# EAGLE design hb-featherwing_v2 (EAGLE 8.3.1)
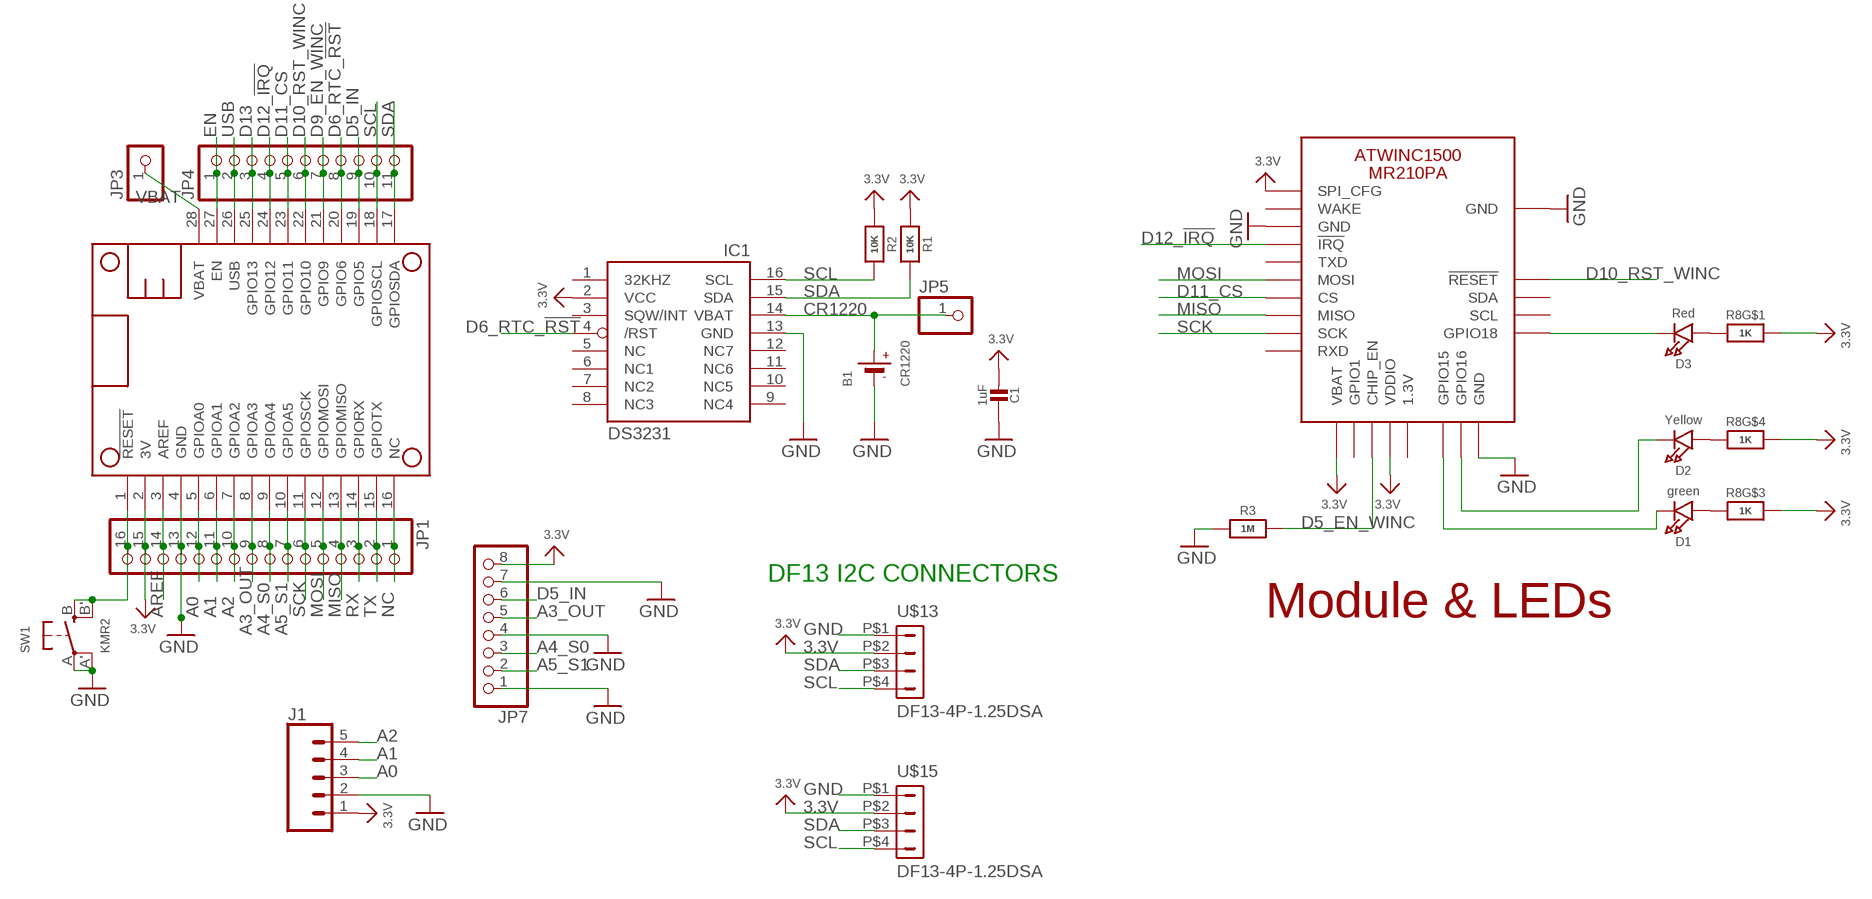
[diagram p0: schematic, sheet 1]

## Parts
B1  CR1220  BATTERYCR1220_2  [CR1220-2]
C1  1uF  CAP_CERAMIC0805-NOOUTLINE  [0805-NO]
D1  green  LED0805_NOOUTLINE  [CHIPLED_0805_NOOUTLINE]
D2  Yellow  LED0805_NOOUTLINE  [CHIPLED_0805_NOOUTLINE]
D3  Red  LED0805_NOOUTLINE  [CHIPLED_0805_NOOUTLINE]
IC1  DS3231/SO  [SO16W]
J1  CONN_05  [1X05]
JP1  HEADER-1X16ROUND  [1X16_ROUND]
JP3  HEADER-1X1ROUND  [1X01_ROUND]
JP4  HEADER-1X11  [1X11_ROUND]
JP5  HEADER-1X1ROUND  [1X01_ROUND]
JP7  PINHD-1X8BIG  [1X08-BIG]
MS1  MICROSHIELD_NODIM  [MICROSHIELD_DIM]
R1  10K  RESISTOR0805_NOOUTLINE  [0805-NO]
R2  10K  RESISTOR0805_NOOUTLINE  [0805-NO]
R3  1M  RESISTOR0805_NOOUTLINE  [0805-NO]
R8  1K  RESISTOR_4PACK  [RESPACK_4X0603]
SW1  KMR2  SWITCH_TACT_SMT4.6X2.8  [BTN_KMR2_4.6X2.8]
U$7  ATWINC1500_MR210PB  ATWINC1500_MR210PA  [ATWINC1500_MR210PA]
U$13  DF13-4P-1.25DSA  [DF13-4P-1.25DSA]
U$15  DF13-4P-1.25DSA  [DF13-4P-1.25DSA]

## Nets
3.3V: C1.2 IC1.2(VCC) J1.1 JP1.15 JP7.8 MS1.2(3V) R1.1 R2.1 R8.5 R8.6 R8.8 U$7.J10(SPI_CFG) U$7.J20(VBAT) U$7.J23(VDDIO) U$13.P$2 U$15.P$2
A0: J1.3 JP1.12 MS1.5(GPIOA0)
A1: J1.4 JP1.11 MS1.6(GPIOA1)
A2: J1.5 JP1.10 MS1.7(GPIOA2)
A3_OUT: JP1.9 JP7.5 MS1.8(GPIOA3)
A4_S0: JP1.8 JP7.3 MS1.9(GPIOA4)
A5_S1: JP1.7 JP7.2 MS1.10(GPIOA5)
AREF: JP1.14 MS1.3(AREF)
CR1220: B1.+ IC1.14(VBAT) JP5.1
D5_EN_WINC: R3.2 U$7.J22(CHIP_EN)
D5_IN: JP4.9 JP7.6 MS1.19(GPIO5)
D6_RTC_!RST: IC1.4(/RST) JP4.8 MS1.20(GPIO6)
D9_EN_WINC: JP4.7 MS1.21(GPIO9)
D10_RST_WINC: JP4.6 MS1.22(GPIO10) U$7.J4(!RESET)
D11_CS: JP4.5 MS1.23(GPIO11) U$7.J16(CS)
D12_!IRQ: JP4.4 MS1.24(GPIO12) U$7.J13(!IRQ)
D13: JP4.3 MS1.25(GPIO13)
EN: JP4.1 MS1.27(EN)
GND: B1.- C1.1 IC1.13(GND) J1.2 JP1.13 JP7.1 JP7.4 JP7.7 MS1.4(GND) R3.1 SW1.A'(P1) SW1.A(P) U$7.J9(GND) U$7.J12(GND) U$7.J28(GND) U$7.MTGND(GND) U$13.P$1 U$15.P$1
GPIO15: D1.C U$7.J26(GPIO15)
GPIO16: D2.C U$7.J27(GPIO16)
GPIO18: D3.C U$7.J1(GPIO18)
MISO: JP1.4 MS1.13(GPIOMISO) U$7.J17(MISO)
MOSI: JP1.5 MS1.12(GPIOMOSI) U$7.J15(MOSI)
N$1: D3.A R8.1
N$22: D2.A R8.4
N$24: D1.A R8.3
N$25: JP1.16 MS1.1(!RESET) SW1.B'(S1) SW1.B(S)
NC: JP1.1 MS1.16(NC)
RX: JP1.3 MS1.14(GPIORX)
SCK: JP1.6 MS1.11(GPIOSCK) U$7.J18(SCK)
SCL: IC1.16(SCL) JP4.10 MS1.18(GPIOSCL) R2.2 U$13.P$4 U$15.P$4
SDA: IC1.15(SDA) JP4.11 MS1.17(GPIOSDA) R1.2 U$13.P$3 U$15.P$3
TX: JP1.2 MS1.15(GPIOTX)
USB: JP4.2 MS1.26(USB)
VBAT: JP3.1 MS1.28(VBAT)
Unconnected: IC1.1(32KHZ) IC1.3(SQW/INT) IC1.5(NC) IC1.6(NC1) IC1.7(NC2) IC1.8(NC3) IC1.9(NC4) IC1.10(NC5) IC1.11(NC6) IC1.12(NC7) R8.2 R8.7 U$7.J2(SCL) U$7.J3(SDA) U$7.J11(WAKE) U$7.J14(TXD) U$7.J19(RXD) U$7.J21(GPIO1) U$7.J24(1.3V)

## Notes on the sheet
- DF13 I2C CONNECTORS
- Module & LEDs

## Library data of the parts
B1 = microbuilder:BATTERY: CR1220 SMT - Digikey: 3001K-ND CD2032 BAT-HLD-001 - Digikey: BAT-HLD-001-ND
C1 = microbuilder:CAP_CERAMIC: Ceramic Capacitors For new designs, use the packages preceded by an '_' character since they are more reliable: The following footprints should be used on most boards: _0402 - Standard footprint for regular board layouts _0603 - Standard footprint for regular board layouts _0805 - Standard footprint for regular board layouts _1206 - Standard footprint for regular board layouts For extremely tight-pitch boards where space is at a premium, the following 'micro-pitch' footprints can be used (smaller pads, no silkscreen outline, etc.): _0402MP - Micro-pitch footprint for very dense/compact boards _0603MP - Micro-pitch footprint for very dense/compact boards _0805MP - Micro-pitch footprint for very dense/compact boards _1206MP - Micro-pitch footprint for very dense/compact boards
D1-D3 = microbuilder:LED: LED 0603 - 0603 Surface Mount Package 2mA: Green LED - Low Power (3.9mcd, 2ma, 1.7Vf) - Digikey: 475-2709-2-ND Orange LED - Low Power (9.8mcd, 2ma, 1.8Vf) - Digikey: 475-1194-2-ND Red LED - Low Power (5mcd, 2ma, 1.8Vf) - Digikey: 475-1195-2-ND Yellow LED - Low Power (7mcd, 2ma, 1.8Vf) - Digikey: 475-1196-2-ND 5mA: Blue LED - Low Power (17mcd, 5ma, 2.9Vf) - Digikey: LNJ937W8CRACT-ND 0805 - 0805 Surface Mount Package 2mA: Red LED (8.8mcd, 2mA, 1.8Vf, Clear) - Low Power [Digikey: 475-2510-1-ND] Green LED (5mcd, 2mA, 1.8Vf, Clear) - Low Power [Digikey: 475-2730-1-ND] Yellow LED (11.3mcd, 2mA, 1.8Vf, Clear) - Low Power [Digikey: 475-2555-1-ND] 20mA: Red LED (104mcd, 20mA, Diffused) - LS R976 [Digikey: 475-1278-6-ND] Red LED (12mcd, 20mA, 2.0Vf, Clear) - APT2012EC [Digikey: 754-1128-1-ND] Green LED (15mcd, 20mA, 2.2Vf, Clear) - APT2012GC [Digikey: 754-1131-1-ND] Orange LED (160mcd, 20mA, 2.1Vf, Clear) - APT2012SECK [Digikey: 754-1130-1-ND] 1206 - 1206 Surface Mount Package Green LED (26mcd, 20mA, Diffused) - LG N971 [Digikey: 475-1407-6-ND] Red LED (15mcd, 20mA, Diffused) - LH N974 [Digikey: 475-1416-6-ND] Cree - Cree High-Power Surface Mount LEDs XPEBWT-L1-0000-00D50 - White 111lm 350mA 2.9Vf 6200K 110° XTEAWT-00-0000-00000LEE3 - White 114lm 350mA 2.85Vf 5000K 115° Everlight - Everlight 45-21 Series Surface Mount LEDs 45-21/QK2C-B2832AC2CB2/2T - Warm White 2000mcd 20mA 3.25Vf 3050K 120° 45-21/LK2C-B38452C4CB2/2T - Nuetral White 2000mcd 20mA 3.25Vf 4150K 120° 45-21/LK2C-B50634C6CB2/2T - Cold White 2200mcd 20mA 3.25Vf 5650K 120° PLCC2 Reverse Mount LS T77K-J1L2-1-0-2-R18-Z - Red 11.25mcd 2mA 1.8Vf 630nm 120° LO T77K-L1M2-24-Z - Orange 19.6mcd 2mA 1.8Vf 606nm 120° LY T77K-K2M1-26-Z - Yellow 15.7mcd 2mA 1.8Vf 587nm 120°
IC1 = adafruit:DS3231
J1 = SparkFun-Connectors:CONN_05: Multi connection point. Often used as Generic Header-pin footprint for 0.1 inch spaced/style header connections On any of the 0.1 inch spaced packages, you can populate with these: Break Away Headers - Straight <https://www.sparkfun.com/products/116> (PRT-00116) Break Away Male Headers - Right Angle <https://www.sparkfun.com/products/553> (PRT-00553) Female Headers <https://www.sparkfun.com/products/115> (PRT-00115) Break Away Headers - Machine Pin <https://www.sparkfun.com/products/117> (PRT-00117) Break Away Female Headers - Swiss Machine Pin <https://www.sparkfun.com/products/743> (PRT-00743) For SCREWTERMINALS and SPRING TERMINALS visit here: Screw Terimnals on SparkFun.com <https://www.sparkfun.com/search/results?term=Screw+Terminals> (5mm/3.5mm/2.54mm spacing) This device is also useful as a general connection point to wire up your design to another part of your project. Our various solder wires solder well into these plated through hole pads. Hook-Up Wire - Assortment (Stranded, 22 AWG) <https://www.sparkfun.com/products/11375> (PRT-11375) Hook-Up Wire - Assortment (Solid Core, 22 AWG) <https://www.sparkfun.com/products/11367> (PRT-11367) View the entire wire category on our website here <https://www.sparkfun.com/categories/141> Special notes: Molex polarized connector foot print use with SKU : PRT-08231 with associated crimp pins and housings. 1MM SMD Version SKU: PRT-10208
JP1 = microbuilder:HEADER-1X16: PIN HEADER
JP3 JP5 = microbuilder:HEADER-1X1: PIN HEADER
JP4 = microbuilder:HEADER-1X11
JP7 = adafruit:PINHD-1X8: PIN HEADER
MS1 = microbuilder:MICROSHIELD
R1-R3 = microbuilder:RESISTOR: Resistors For new designs, use the packages preceded by an '_' character since they are more reliable: The following footprints should be used on most boards: _0402 - Standard footprint for regular board layouts _0603 - Standard footprint for regular board layouts _0805 - Standard footprint for regular board layouts _1206 - Standard footprint for regular board layouts For extremely tight-pitch boards where space is at a premium, the following 'micro-pitch' footprints can be used (smaller pads, no silkscreen outline, etc.): _0402MP - Micro-pitch footprint for very dense/compact boards _0603MP - Micro-pitch footprint for very dense/compact boards _0805MP - Micro-pitch footprint for very dense/compact boards _1206MP - Micro-pitch footprint for very dense/compact boards
R8 = microbuilder:RESISTOR_4PACK: Resistor Packs (4 resistors) 4 x 0603 10K 1/16W - Digikey: YC164J-10KCT-ND
SW1 = microbuilder:SWITCH_TACT_SMT: SMT Tact Switches 6x6mm - Digikey: P12940SCT-ND KMR2 (4.6x2.8mm) - Digikey: 401-1426-1-ND EVQ-PQHB55 - Light Touch, 160GF (4.5x4.5mm) - Digikey: P8090SCT-ND KMT0 - KMT021 NGJ LHS (etc.) IP68/Waterproof - Digikey: CKN10289CT-ND
U$7 = microbuilder:ATWINC1500_MR210PA: ATWINC1500_MR210PA wifi module
U$13 U$15 = con-hirose-df13:DF13-4P-1.25: DF13-4P 1.25mm Pitch Miniature Crimping Connector.

## Board
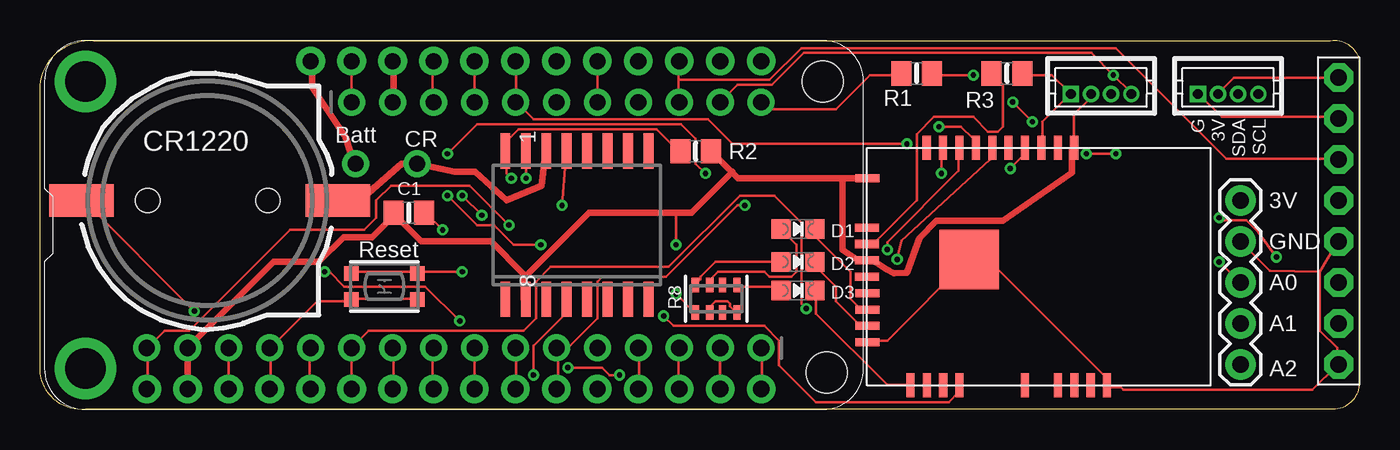
[diagram p1: board, top side]
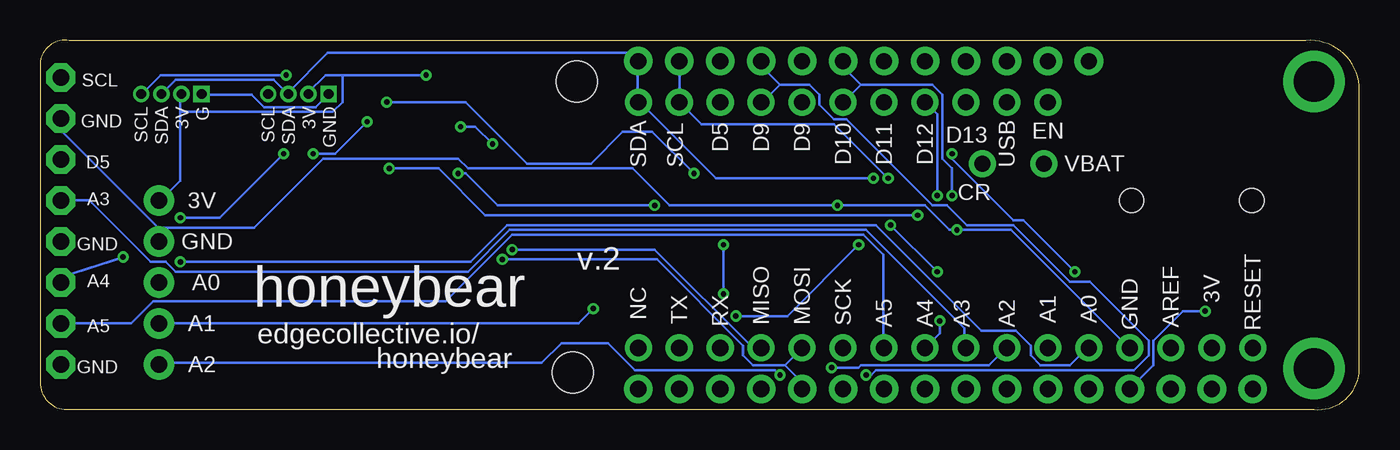
[diagram p2: board, bottom side, seen from below]

Size 81.79 x 22.89 mm. Coordinates in mm from the lower left corner, seen from the top.
Outline: 80.01,0.01 2.79,0.01 arc-90 0,2.3 0,20.08 arc-90 3.3,22.87 80.01,22.87 arc-90 81.79,21.6 81.79,1.54 arc-90 80.01,0.01
Copper layers (1*16): Top 0.0356mm / dielectric 1.5011mm / Bottom 0.0356mm
Design rules "LaenPCBOrder": minimum track width 6mil, minimum drill 13mil, track to track 6mil, track to pad 6mil, pad to pad 6mil, via to via 6mil, smd to smd 6mil, copper to edge 15mil, drill to drill 6mil, minimum pad ring 7mil, minimum via ring 7mil, stop-mask expansion 3mil, vias tented up to drill 0mil, thermal gap 10mil

### Footprints (pad centres in the part's own frame; a part is rotated, then mirrored left to right if it is on the bottom)
CR1220-2 = smd 4 x 2: + 8.29,0; - -7.6,0 | hole 1.5: 3.95,0; -3.5,0
0805-NO = smd 1.24 x 1.5: 1 -0.95,0; 2 0.95,0
CHIPLED_0805_NOOUTLINE = smd 1.2 x 1.2: A 0,-1.05; C 0,1.05
SO16W = smd 0.6 x 2.2: 1 -4.445,-4.6; 2 -3.175,-4.6; 3 -1.905,-4.6; 4 -0.635,-4.6; 5 0.635,-4.6; 6 1.905,-4.6; 7 3.175,-4.6; 8 4.445,-4.6; 9 4.445,4.6; 10 3.175,4.6; 11 1.905,4.6; 12 0.635,4.6; 13 -0.635,4.6; 14 -1.905,4.6; 15 -3.175,4.6; 16 -4.445,4.6
1X05 = drill 1.016 pad 1.88: 1 0,0; 2 2.54,0; 3 5.08,0; 4 7.62,0; 5 10.16,0
1X16_ROUND = drill 1 pad 1.676: 1 -19.05,0; 2 -16.51,0; 3 -13.97,0; 4 -11.43,0; 5 -8.89,0; 6 -6.35,0; 7 -3.81,0; 8 -1.27,0; 9 1.27,0; 10 3.81,0; 11 6.35,0; 12 8.89,0; 13 11.43,0; 14 13.97,0; 15 16.51,0; 16 19.05,0
1X01_ROUND = drill 1 pad 1.676: 1 0,0
1X11_ROUND = drill 1 pad 1.676: 1 -12.7,0; 2 -10.16,0; 3 -7.62,0; 4 -5.08,0; 5 -2.54,0; 6 0,0; 7 2.54,0; 8 5.08,0; 9 7.62,0; 10 10.16,0; 11 12.7,0
1X08-BIG = drill 1.016 pad 1.778 octagon: 1 -8.89,0; 2 -6.35,0; 3 -3.81,0; 4 -1.27,0; 5 1.27,0; 6 3.81,0; 7 6.35,0; 8 8.89,0
MICROSHIELD_DIM = drill 1 pad 1.778: 1 6.35,1.27; 2 8.89,1.27; 3 11.43,1.27; 4 13.97,1.27; 5 16.51,1.27; 6 19.05,1.27; 7 21.59,1.27; 8 24.13,1.27; 9 26.67,1.27; 10 29.21,1.27; 11 31.75,1.27; 12 34.29,1.27; 13 36.83,1.27; 14 39.37,1.27; 15 41.91,1.27; 16 44.45,1.27; 17 44.45,21.59; 18 41.91,21.59; 19 39.37,21.59; 20 36.83,21.59; 21 34.29,21.59; 22 31.75,21.59; 23 29.21,21.59; 24 26.67,21.59; 25 24.13,21.59; 26 21.59,21.59; 27 19.05,21.59; 28 16.51,21.59 | drill 2.5 pad 3.81: P$1 2.54,20.32; P$2 2.54,2.54 | hole 2.54: 48.26,20.32; 48.514,2.286
RESPACK_4X0603 = smd 0.45 x 0.9: 1 -1.3,-0.85; 2 -0.4,-0.85; 3 0.4,-0.85; 4 1.3,-0.85; 5 1.3,0.85; 6 0.4,0.85; 7 -0.4,0.85; 8 -1.3,0.85
BTN_KMR2_4.6X2.8 = smd 0.9 x 0.9: A 2.05,0.8; A' -2.05,0.8; B 2.05,-0.8; B' -2.05,-0.8
ATWINC1500_MR210PA = smd 1.5 x 0.5: J1 7.146,-4.973; J2 7.146,-3.957; J3 7.146,-2.941; J4 7.146,-1.925; J5 7.146,2.139; J6 7.146,4.171; J7 7.146,5.187; J8 7.146,6.203; J9 7.146,7.219; J10 -7.584,5.181; J11 -7.584,4.165; J12 -7.584,3.149; J13 -7.584,2.133; J14 -7.584,1.117; J15 -7.584,0.101; J16 -7.584,-0.915; J17 -7.584,-1.931; J18 -7.584,-2.947; J19 -7.584,-3.963 | smd 0.5 x 1.5: J20 -5.684,-7.643; J21 -2.636,-7.663; J22 -1.62,-7.663; J23 -0.604,-7.663; J24 0.412,-7.663; J25 1.428,-7.643; J26 2.444,-7.643; J27 3.46,-7.643; J28 4.476,-7.643 | smd 3.7 x 3.7: MTGND -0.666,-1.331
DF13-4P-1.25DSA = drill 0.6 pad 1.016 square: P$1 1.875,0 | drill 0.6 pad 1.016: P$2 0.625,0; P$3 -0.625,0; P$4 -1.875,0

### Placement (x,y rotation side)
B1  10.16,12.97 0 top
C1  22.86,12.2 180 top
D1  46.99,11.19 270 top
D2  46.99,9.16 270 top
D3  46.99,7.38 270 top
IC1  33.27,11.44 0 top
J1  74.42,12.97 270 top
JP1  25.65,3.82 180 top
JP3  19.56,15.25 0 top
JP4  32,19.06 0 top
JP5  23.37,15.25 0 top
JP7  80.52,11.7 90 top
MS1  0.25,0.01 0 top
R1  54.36,20.84 180 top
R2  40.64,16.01 180 top
R3  59.94,20.84 180 top
R8  41.91,6.87 180 top
SW1  21.34,7.63 180 top
U$7  58.93,8.65 270 top
U$13  65.79,19.57 180 top
U$15  73.66,19.57 180 top

### Tracks (layer width: path | path; a pad name or v marks a point on that pad's centre or on a via)
3.3V  (via drill 0.33)
  Top 0.152: U$13.P$2 65.02,19.52 65.02,19.21 64.11,18.3 64.11,16.32 U$7.J10 63.96,16.17 | v57.86,20.74 55.42,20.74 R1.1 | JP7.8 74.02,20.59 73.1,19.67 U$15.P$2 | 50.6,9.31 51.16,9.31 U$7.J23 51.31,9.16 51.77,9.16 | 41.25,6.11 41.4,6.11 R8.6 | 41.25,6.11 40.64,6.11 R8.5 40.49,6.11 v39.42,7.18 | 41.25,6.11 41.86,6.72 42.62,6.72 42.77,6.57 42.77,6.41 43.08,6.11 R8.8 | 22.05,11.95 22.05,12.2 C1.2 | JP1.15 9.25,3.67 9.14,3.57 | 39.42,12.2 v39.42,10.22 | IC1.2 30.12,6.87 29.97,6.87 | 42.87,14.74 42.93,14.8 42.93,14.74
  Top 0.406: U$7.J20 49.73,14.33 | 49.73,14.33 43.27,14.33 42.87,14.74 R2.1 | JP1.15 14.48,9.16 17.27,9.16 18.8,10.68 20.57,10.68 21.84,11.95 22.05,11.95 22.1,11.95 23.62,10.43 27.94,10.43 29.97,8.39 29.97,8.14 | MS1.2 9.14,3.57 | 29.97,6.87 29.97,8.14 | 29.97,8.14 34.04,12.2 39.42,12.2 40.39,12.2 42.93,14.74 | 50.6,9.31 49.73,9.92 49.73,14.33 | 63.96,16.17 63.96,14.69 59.69,11.7 55.57,11.7 54.51,10.63 53.75,8.5 52.93,8.45 52.48,8.7 51.77,9.16
  Bottom 0.152: 63.04,20.74 64.11,20.74 65.18,19.67 U$13.P$2 | 63.04,20.74 v57.86,20.74 | 73.1,18.45 73.1,14.19 74.32,12.97 J1.1 | 73.1,18.45 73.1,19.52 U$15.P$2 | 63.04,20.74 63.04,19.06 63.65,18.45 73.1,18.45 | v39.42,10.22 v39.42,7.18
A0  (via drill 0.33)
  Top 0.152: JP1.12 16.71,3.82 16.71,1.38 MS1.5 | v73.1,9.16 74.32,7.94 J1.3
  Bottom 0.152: v73.1,9.16 55.12,9.16 52.83,11.44 29.97,11.44 23.42,4.89 21.29,4.89 20.37,3.97 20.37,3.37 19.76,2.76 17.93,2.76 16.87,3.82 JP1.12
A1  (via drill 0.33)
  Top 0.152: MS1.6 JP1.11 20.37,4.89 29.97,4.89 30.73,5.65 30.73,7.94 31.65,8.85 38.96,8.85 43.38,13.27 45.52,13.27 47.19,11.59 47.19,6.57 v47.5,6.26
  Bottom 0.152: J1.4 48.41,5.35 v47.5,6.26
A2  (via drill 0.33)
  Top 0.152: JP1.10 21.89,3.82 21.89,1.38 MS1.7 | v35.92,2.15 35.31,2.15 34.85,2.6 v32.71,2.6
  Bottom 0.152: v35.92,2.15 36.22,2.45 44.91,2.45 46.58,4.13 49.48,4.13 50.7,2.91 74.32,2.91 J1.5 | v32.71,2.6 31.04,2.6 30.89,2.76 22.96,2.76 21.89,3.82 JP1.10
A3_OUT
  Top 0.152: JP1.9 24.33,3.82 24.33,1.38 MS1.8
  Bottom 0.152: JP7.5 78.74,12.97 74.93,9.16 74.02,9.16 73.41,8.55 55.27,8.55 52.68,11.14 30.58,11.14 24.49,5.04 24.49,3.82 JP1.9
A4_S0  (via drill 0.33)
  Top 0.152: MS1.9 JP1.8 | v76.66,9.46 75.54,10.99 74.78,11.75 73.25,11.75 v73.1,11.9 | v64.87,15.86 v66.7,15.86 | v60.3,19.06 v61.52,17.84 | v41.25,14.64 40.64,15.25 40.64,16.78 39.73,17.69 27.08,17.69 v25.25,15.86 | v17.63,8.55 17.93,8.55 18.85,7.63 23.88,7.63 v26.01,5.5
  Bottom 0.152: v76.66,9.46 80.42,8.24 80.42,7.94 JP7.3 | v73.1,11.9 70.66,11.9 v66.7,15.86 | v64.87,15.86 63.5,15.86 v61.52,17.84 | v60.3,19.06 55.42,19.06 51.61,15.25 47.65,15.25 45.67,17.23 43.84,17.23 v41.25,14.64 | v25.25,15.86 25.25,15.56 21.44,11.75 20.83,11.75 v17.63,8.55 | v26.01,5.5 26.01,4.74 JP1.8
A5_S1
  Top 0.152: JP1.7 29.52,3.82 29.52,1.38 MS1.10
  Bottom 0.152: JP7.2 76.15,5.35 74.78,6.72 56.64,6.72 52.53,10.83 30.73,10.83 29.52,9.61 29.52,3.82 JP1.7
AREF
  Top 0.152: MS1.3 JP1.14
CR1220
  Top 0.152: 31.34,16.01 IC1.14 | 20.12,13.22 B1.+
  Top 0.406: 31.34,16.01 31.09,13.88 28.91,12.97 26.98,14.74 25.71,14.74 JP5.1 22.4,15.25 20.12,13.22
D5_EN_WINC
  Top 0.152: U$7.J22 51.31,10.38 51.77,10.38 54.36,12.97 54.36,17.08 55.42,18.15 57.86,18.15 58.78,17.23 59.38,17.23 59.69,17.54 59.69,20.13 59.08,20.74 R3.2
D5_IN
  Top 0.152: 39.57,20.43 39.57,21.5 MS1.19 | 39.57,20.43 39.57,19.06 JP4.9 | 39.57,20.43 45.21,20.43 47.19,22.42 66.7,22.42 73.56,15.56 80.42,15.56 JP7.6
D6_RTC_!RST  (via drill 0.33)
  Top 0.152: v30.58,2.15 30.58,3.97 32.56,5.96 32.56,6.72 IC1.4
  Bottom 0.152: v30.58,2.15 30.28,2.15 29.97,2.45 13.97,2.45 13.06,3.37 13.06,4.28 16.71,7.94 17.93,7.94 21.44,11.44 24.33,11.44 25.55,12.66 26.47,12.66 31.8,18 32.56,18 33.48,18.91 33.48,19.52 34.09,20.13 35.92,20.13 | 35.92,20.13 36.98,19.06 JP4.8 | 35.92,20.13 36.98,21.2 36.98,21.5 MS1.20
D9_EN_WINC
  Top 0.152: MS1.21 JP4.7
D10_RST_WINC  (via drill 0.33)
  Top 0.152: v38.66,5.8 39.27,5.19 44.91,5.19 45.82,4.28 45.82,2.76 48.11,0.47 56.34,0.47 56.95,1.08 56.95,1.38 U$7.J4 | v31.04,10.22 29.36,10.22 28.14,11.44 27.08,11.44 v25.25,13.27
  Bottom 0.152: v38.66,5.8 35.46,5.8 v31.04,10.22 | v25.25,13.27 25.25,14.95 25.86,15.56 25.86,19.52 26.47,20.13 30.89,20.13 | 30.89,20.13 31.95,19.06 JP4.6 | 30.89,20.13 31.95,21.2 31.95,21.5 MS1.22
D11_CS  (via drill 0.33)
  Top 0.152: v55.73,17.54 57.1,17.54 57.86,16.78 57.86,16.32 U$7.J16 | v53.75,16.47 42.93,16.47 41.4,18 30.58,18 29.52,19.06 | 29.52,19.06 29.52,21.5 MS1.23 | 29.52,19.06 JP4.5
  Bottom 0.152: v55.73,17.54 54.81,17.54 v53.75,16.47
D12_!IRQ  (via drill 0.33)
  Top 0.152: v60.15,14.95 60.91,15.71 60.91,16.17 U$7.J13 | v26.16,13.27 v27.38,12.05 | JP4.4 MS1.24
  Bottom 0.152: v60.15,14.95 57.1,14.95 54.2,12.05 v27.38,12.05 | v26.16,13.27 26.16,18.3 JP4.4
D13
  Top 0.152: JP4.3 24.33,19.06 24.33,21.5 MS1.25
EN
  Top 0.152: MS1.27 JP4.1
GND  (via drill 0.33)
  Top 0.152: SW1.A' 23.27,6.87 19.3,6.87 SW1.A 19.15,6.72 17.17,6.72 14.28,3.82 | v24.94,11.14 23.88,12.2 C1.1 | v32.36,12.66 32.56,15.4 32.56,16.01 IC1.13 | 14.28,3.82 14.28,1.38 MS1.4 | 14.28,3.82 JP1.13 | v9.55,6.11 2.69,12.97 B1.- | U$7.J28 51.31,4.28 52.53,4.28 57.56,9.31 U$7.MTGND 57.71,9.31 58.78,9.31 66.09,1.99 66.09,1.54 U$7.J9 66.24,1.38 67.01,1.38 67.16,1.23 78.89,1.23 80.42,2.76 JP7.1 80.42,2.91 80.42,3.82 79.35,4.89 79.35,8.55 | 79.35,8.55 80.42,10.38 JP7.4 | J1.2 76.25,8.6 79.35,8.55 | R3.1 60.91,20.74 62.74,20.74 63.8,19.67 U$13.P$1 63.8,19.52 62.13,17.84 62.13,16.32 U$7.J12 | JP7.7 80.42,18.15 73.25,18.15 71.88,19.52 U$15.P$1
  Bottom 0.152: JP1.13 14.28,3.82 21.59,11.14 v24.94,11.14 25.4,11.14 26.92,12.66 v32.36,12.66 42.77,12.66 45.06,14.95 55.27,14.95 55.88,15.56 64.26,15.56 68.53,11.29 74.47,11.29 | v9.55,6.11 10.92,6.11 12.75,4.28 12.75,2.76 MS1.4 | U$15.P$1 71.73,19.52 68.68,19.52 67.92,18.76 64.72,18.76 63.96,19.52 U$13.P$1 | 74.47,11.29 74.47,10.53 J1.2 74.47,11.29 | 74.47,11.29 80.42,17.23 80.42,18 JP7.7
GPIO15
  Top 0.152: D1.C 48.11,11.14 48.11,10.68 50.24,8.55 50.24,6.87 50.85,6.26 51.16,6.26 U$7.J26
GPIO16
  Top 0.152: D2.C 48.11,9.16 48.11,8.85 49.33,7.63 49.33,6.72 50.85,5.19 51.16,5.19 U$7.J27
GPIO18
  Top 0.152: D3.C 48.11,7.33 48.11,5.96 52.53,1.54 53.9,1.54 U$7.J1
MISO  (via drill 0.33)
  Top 0.152: v52.53,9.92 52.53,10.38 56.95,14.8 56.95,16.17 U$7.J17 | MS1.13 37.13,1.38 37.13,3.82 JP1.4
  Bottom 0.152: v52.53,9.92 43.69,9.92 37.59,3.82 JP1.4
MOSI  (via drill 0.33)
  Top 0.152: v53.14,9.31 53.39,10.48 58.93,15.51 58.93,16.17 U$7.J15
  Bottom 0.152: v53.14,9.31 43.54,9.31 38.2,3.97 38.2,3.37 37.59,2.76 35.61,2.76 | JP1.5 35.61,2.76 | MS1.12 34.54,1.69 35.61,2.76
N$1
  Top 0.152: R8.1 43.23,7.63 45.67,7.63 45.82,7.48 D3.A
N$22
  Top 0.152: D2.A 41.86,9.16 40.95,8.24 40.95,8.09 40.64,7.78 R8.4
N$24
  Top 0.152: R8.3 41.55,7.78 41.55,8.09 42.01,8.55 44.91,8.55 45.21,8.24 46.58,8.24 46.89,8.55 46.89,10.22 45.97,11.14 D1.A
N$25  (via drill 0.33)
  Top 0.152: SW1.B 19.3,8.55 23.27,8.55 SW1.B' 23.42,8.55 v26.16,8.55 | v29.06,11.44 26.62,13.88 21.74,13.88 20.83,12.97 20.83,11.9 20.07,11.14 15.49,11.14 9.25,4.89 7.72,4.89 6.65,3.82 | 6.65,3.82 6.65,1.38 MS1.1 | 6.65,3.82 JP1.16
  Bottom 0.152: v29.06,11.44 v26.16,8.55
NC
  Top 0.152: JP1.1 44.75,3.82 44.75,1.38 MS1.16
RX
  Top 0.152: JP1.3 39.57,3.82 39.57,1.38 MS1.14
SCK  (via drill 0.33)
  Top 0.152: v55.88,14.64 55.88,16.17 U$7.J18 | v43.69,12.66 43.23,12.66 38.81,8.24 34.85,8.24 34.54,7.94 34.54,5.65 32.71,3.82 32.11,3.82 | 32.11,3.82 32.11,1.38 MS1.11 | 32.11,3.82 JP1.6
  Bottom 0.152: v55.88,14.64 55.42,14.64 53.44,12.66 v43.69,12.66
SCL  (via drill 0.33)
  Top 0.152: R2.2 39.57,16.01 38.2,17.39 29.67,17.39 28.91,16.62 28.91,16.17 IC1.16 28.91,16.01 28.91,14.64 v29.21,14.34 | JP4.10 43.23,20.13 45.36,20.13 47.35,22.11 65.18,22.11 v66.55,20.74 67.62,19.67 U$13.P$4
  Bottom 0.152: v66.55,20.74 74.32,20.74 75.39,19.67 U$15.P$4 | MS1.18 JP4.10 40.79,17.69 32.56,17.69 v29.21,14.34
SDA  (via drill 0.33)
  Top 0.152: R1.2 53.29,20.74 51.46,20.74 49.33,18.61 45.21,18.61 44.75,19.06 JP4.11 | v30.12,14.34 30.12,16.01 IC1.15
  Bottom 0.152: U$15.P$3 74.17,19.67 73.41,20.43 67.31,20.43 66.55,19.67 U$13.P$3 66.4,19.67 63.96,22.11 45.21,22.11 MS1.17 44.75,21.5 44.75,19.06 JP4.11 44.6,19.06 39.88,14.34 v30.12,14.34
TX
  Top 0.152: MS1.15 JP1.2
USB
  Top 0.152: 21.89,19.06 JP4.2 | 21.89,21.5 MS1.26
  Top 0.406: 21.89,21.5 21.89,19.06
VBAT
  Top 0.152: 19.46,15.25 JP3.1 | 16.87,21.5 MS1.28
  Top 0.406: 19.46,15.25 18.95,16.88 16.87,19.98 16.87,21.5

### Text on the board
tPlace: Batt | CR | CR1220 | Reset
tNames: G | 3V | SDA | SCL | 1 | R2 | 3V | GND | 8 | A0 | A1 | A2
bNames: SCL | GND | 3V | SDA | SCL | G | 3V | SDA | SCL | EN | D12 | D11 | D10 | D9 | D9 | D5 | SCL | GND | D13 | D5 | VBAT | USB | SDA | CR | A3 | 3V | GND | GND | RESET | AREF | MOSI | MISO | v.2 | 3V | GND | SCK | NC | A4 | A0 | A1 | A2 | A3 | A4 | A5 | RX | TX | A0 | honeybear | A5 | A1 | edgecollective.io/ | honeybear | A2 | GND